# EAGLE design MHR15-inverter_current_sensors-v1 (EAGLE 6.6.0)
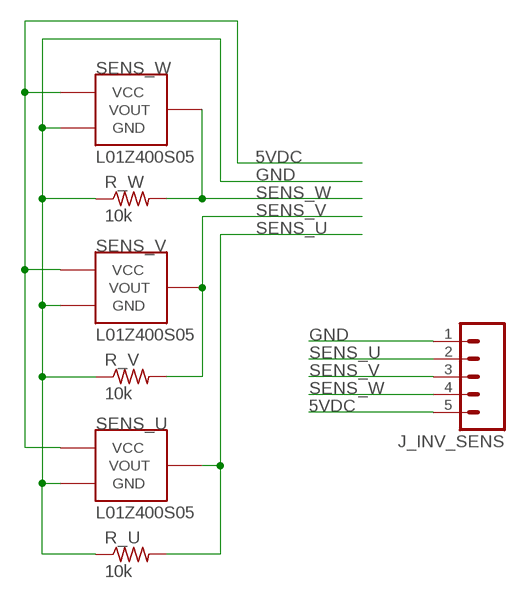
[diagram p0: schematic, sheet 1]

## Parts
J_INV_SENS  M05LOCK  [1X05_LOCK]
R_U  10k  R-US_R0603  [R0603]
R_V  10k  R-US_R0603  [R0603]
R_W  10k  R-US_R0603  [R0603]
SENS_U  L01Z400S05  [L01Z400S05]
SENS_V  L01Z400S05  [L01Z400S05]
SENS_W  L01Z400S05  [L01Z400S05]

## Nets
5VDC: J_INV_SENS.5 SENS_U.VCC SENS_V.VCC SENS_W.VCC
GND: J_INV_SENS.1 R_U.1 R_V.1 R_W.1 SENS_U.GND SENS_V.GND SENS_W.GND
SENS_U: J_INV_SENS.2 R_U.2 SENS_U.VOUT
SENS_V: J_INV_SENS.3 R_V.2 SENS_V.VOUT
SENS_W: J_INV_SENS.4 R_W.2 SENS_W.VOUT

## Library data of the parts
J_INV_SENS = SparkFun-Connectors:M05: Header 5 Standard 5-pin 0.1" header. Use with straight break away headers (SKU : PRT-00116), right angle break away headers (PRT-00553), swiss pins (PRT-00743), machine pins (PRT-00117), and female headers (PRT-00115). Molex polarized connector foot print use with SKU : PRT-08230 with associated crimp pins and housings.
R_U R_V R_W = rcl:R-US_: RESISTOR, American symbol
SENS_U SENS_V SENS_W = MHR15-TS:L01Z400S05: SENSOR CURRENT 400A 5V BI MOD; DIGIKEY_PN: MT7178-ND; MANUFACTURER: Tamura; MFC_PN: L01Z400S05

## Board
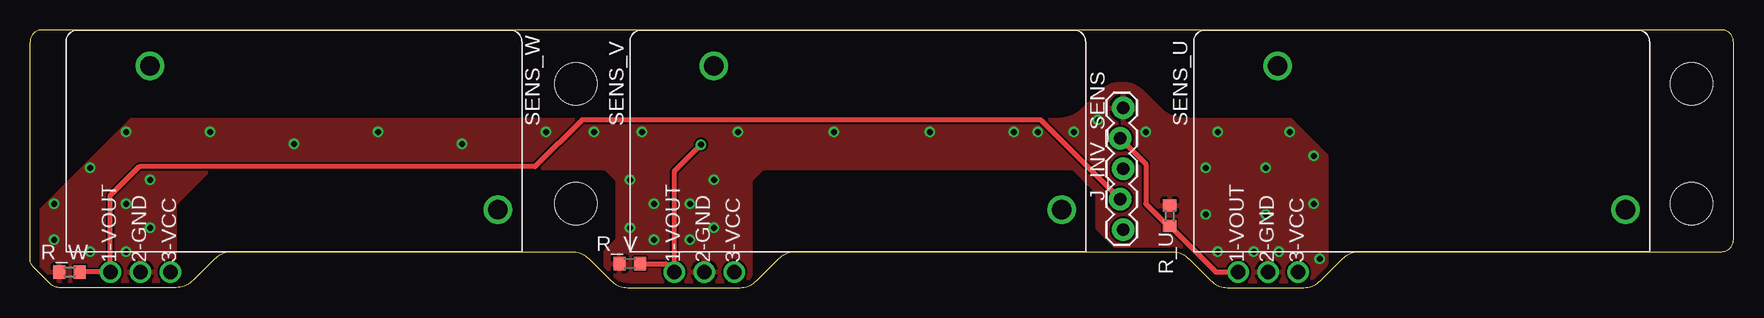
[diagram p1: board, top side]
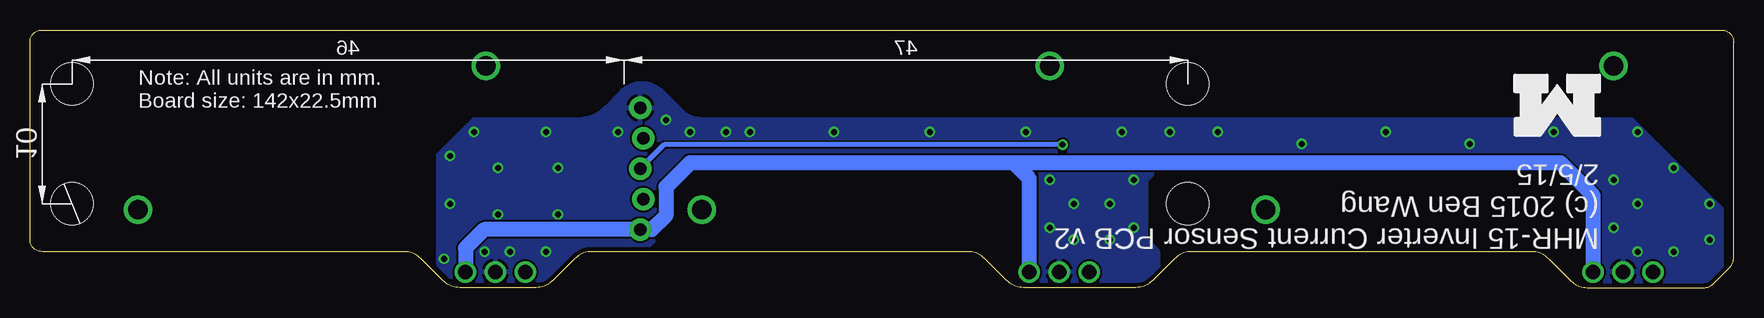
[diagram p2: board, bottom side, seen from below]

Size 142 x 21.5 mm. Coordinates in mm from the lower left corner, seen from the top.
Outline: 141,21.5 1,21.5 arc90 0,20.5 0,2.41 arc45 0.29,1.71 1.71,0.29 arc45 2.41,0 12.17,0 arc45 13.59,0.59 15.41,2.41 arc-45 16.83,3 45.17,3 arc-45 46.59,2.41 48.41,0.59 arc45 49.83,0 59.17,0 arc45 60.59,0.59 62.41,2.41 arc-45 63.83,3 95.17,3 arc-45 96.59,2.41 98.41,0.59 arc45 99.83,0 106.17,0 arc45 107.59,0.59 109.41,2.41 arc-45 110.83,3 141,3 arc90 142,4 142,20.5 arc90 141,21.5
Copper layers (1*16): Top 0.0356mm / dielectric 1.5011mm / Bottom 0.0356mm
Design rules "LaenPCBOrder": minimum track width 6mil, minimum drill 13mil, track to track 6mil, track to pad 6mil, pad to pad 6mil, via to via 6mil, smd to smd 6mil, copper to edge 15mil, drill to drill 6mil, minimum pad ring 7mil, minimum via ring 7mil, stop-mask expansion 3mil, vias tented up to drill 0mil, thermal gap 10mil
Holes 3.5 mm at 45.5,17 45.5,7 138.5,17 138.5,7

### Footprints (pad centres in the part's own frame; a part is rotated, then mirrored left to right if it is on the bottom)
1X05_LOCK = drill 1.016 pad 1.88: 1 0,0.127; 2 2.54,-0.127; 3 5.08,0.127; 4 7.62,-0.127; 5 10.16,0.127
R0603 = smd 1 x 1.1: 1 -0.85,0; 2 0.85,0
L01Z400S05 = drill 1.2: GND -15.3,-5.2; VCC -12.8,-5.2; VOUT -17.8,-5.2 | drill 1.6: MOUNT1 -14.5,12; MOUNT2 14.5,0

### Placement (x,y rotation side)
J_INV_SENS  91,15 270 top
R_U  95,6 270 top
R_V  50,2 0 top
R_W  3.3,1.3 0 top
SENS_U  118.5,6.5 0 top
SENS_V  71.5,6.5 0 top
SENS_W  24.5,6.5 0 top

### Tracks (layer width: path | path; a pad name or v marks a point on that pad's centre or on a via)
5VDC
  Bottom 1.27: SENS_W.VCC 11.7,7.7 14.4,10.4 60,10.4 | SENS_V.VCC 58.7,9.1 60,10.4 | 60,10.4 87,10.4 89,8.4 89,6 90.16,4.84 J_INV_SENS.5 104.16,4.84 105.7,3.3 SENS_U.VCC
GND  (via drill 0.5)
  other vias: 105,13 107,11 107.5,2.4 93,13 87,13 84,13 98,6.1 99,13 103,6.1 104.1,3 47,13 51,13 59,13 67,13 75,13 57,9 50,9 50,5 57,5 55,7 52,7 52,4 55,4 43,13 2,7 5,3 8,3 8,7 5,10 36,12 29,13 22,12 15,13 8,13 10,5 10,9 103,10 98,10 107,7 2,4 89,14 82,13 102,3 99,3
  pour Top: 105,14 108,11 108,2 106,0 94,0 89,5 89,8 87,10 61,10 60,9 60,1 58,-1 50,-1 48,1 48,3 49,4 49,9 48,10 15,10 12,7 12,0 11,-1 2,-1 1,0 1,6.5 8.5,14
  pour Bottom: 105,14 108,11 108,2 106,0 94,0 89,5 89,8 87,10 61,10 60,9 60,1 58,-1 50,-1 48,1 48,3 49,4 49,9 48,10 15,10 12,7 12,0 11,-1 2,-1 1,0 1,6.5 8.5,14
  pour Top: 91,17 arc-45 92.71,16.29 94,15 94.12,14.88 arc45 96.24,14 97,14 97,13 85,13 85,14 85.76,14 arc45 87.88,14.88 88,15 89.29,16.29 arc-45
  pour Bottom: 91,17 arc-45 92.71,16.29 94,15 94.12,14.88 arc45 96.24,14 97,14 97,13 86,13 86,14 arc45 87.71,14.71 88,15 89.29,16.29 arc-45
SENS_U
  Top 0.406: J_INV_SENS.2 93,10.33 93,7 94.85,5.15 R_U.2 98.85,1.3 SENS_U.VOUT
SENS_V  (via drill 0.5)
  Top 0.406: R_V.2 53,2 SENS_V.VOUT 53.7,9.7 v55.92,11.92
  Bottom 0.406: v55.92,11.92 89.13,11.92 J_INV_SENS.3
SENS_W
  Top 0.406: R_W.2 SENS_W.VOUT 6.7,7.7 9.1,10.1 42.1,10.1 46,14 84.25,14 J_INV_SENS.4

### Text on the board
bNames: Note: All units are in mm. / Board size: 142x22.5mm | MHR-15 Inverter Current Sensor PCB v2 / (c) 2015 Ben Wang / 2/5/15
Measures: Note: All units are in mm